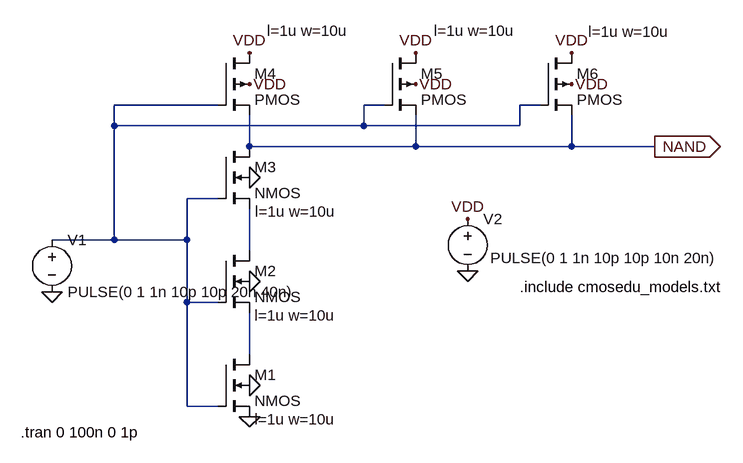
[diagram p0: schematic Nand2.asc]
Nand2.asc, the LTspice schematic file:
Version 4
SHEET 1 1060 680
WIRE 256 -160 96 -160
WIRE 512 -160 480 -160
WIRE 752 -160 720 -160
WIRE 96 -128 96 -160
WIRE 480 -128 480 -160
WIRE 480 -128 96 -128
WIRE 720 -128 720 -160
WIRE 720 -128 480 -128
WIRE 304 -96 304 -144
WIRE 560 -96 560 -144
WIRE 560 -96 304 -96
WIRE 800 -96 800 -144
WIRE 800 -96 560 -96
WIRE 928 -96 800 -96
WIRE 256 -16 208 -16
WIRE 96 48 96 -128
WIRE 96 48 0 48
WIRE 208 48 208 -16
WIRE 208 48 96 48
WIRE 304 64 304 0
WIRE 208 144 208 48
WIRE 256 144 208 144
WIRE 304 224 304 160
WIRE 208 304 208 144
WIRE 256 304 208 304
FLAG 304 112 0
FLAG 304 272 0
FLAG 304 -48 0
FLAG 640 96 0
FLAG 0 128 0
FLAG 304 320 0
FLAG 640 16 VDD
FLAG 304 -192 VDD
FLAG 560 -192 VDD
FLAG 800 -192 VDD
FLAG 800 -240 VDD
FLAG 560 -240 VDD
FLAG 304 -240 VDD
FLAG 928 -96 NAND
IOPIN 928 -96 Out
SYMBOL voltage 640 0 R0
WINDOW 3 35 76 Left 2
WINDOW 123 0 0 Left 0
WINDOW 39 24 124 Left 2
SYMATTR InstName V2
SYMATTR Value PULSE(0 1 1n 10p 10p 10n 20n)
SYMBOL nmos4 256 224 R0
WINDOW 123 56 100 Left 2
SYMATTR InstName M1
SYMATTR Value2 l=1u w=10u
SYMBOL nmos4 256 64 R0
WINDOW 123 56 100 Left 2
SYMATTR InstName M2
SYMATTR Value2 l=1u w=10u
SYMBOL nmos4 256 -96 R0
WINDOW 123 57 100 Left 2
SYMATTR InstName M3
SYMATTR Value2 l=1u w=10u
SYMBOL pmos4 256 -240 R0
WINDOW 123 75 -34 Left 2
SYMATTR InstName M4
SYMATTR Value2 l=1u w=10u
SYMBOL pmos4 512 -240 R0
WINDOW 123 76 -34 Left 2
SYMATTR InstName M5
SYMATTR Value2 l=1u w=10u
SYMBOL pmos4 752 -240 R0
WINDOW 123 74 -33 Left 2
SYMATTR InstName M6
SYMATTR Value2 l=1u w=10u
SYMBOL voltage 0 32 R0
WINDOW 123 0 0 Left 0
WINDOW 39 0 0 Left 0
SYMATTR InstName V1
SYMATTR Value PULSE(0 1 1n 10p 10p 20n 40n)
TEXT 720 120 Left 2 !.include cmosedu_models.txt
TEXT -48 344 Left 2 !.tran 0 100n 0 1p

The netlist it stands for:
* Nand2.asc
V2 VDD 0 PULSE(0 1 1n 10p 10p 10n 20n)
M1 N003 N001 0 0 NMOS l=1u w=10u
M2 N002 N001 N003 0 NMOS l=1u w=10u
M3 NAND N001 N002 0 NMOS l=1u w=10u
M4 VDD N001 NAND VDD PMOS l=1u w=10u
M5 VDD N001 NAND VDD PMOS l=1u w=10u
M6 VDD N001 NAND VDD PMOS l=1u w=10u
V1 N001 0 PULSE(0 1 1n 10p 10p 20n 40n)
.model NMOS NMOS
.model PMOS PMOS
.lib standard.mos
.include cmosedu_models.txt
.tran 0 100n 0 1p
.backanno
.end